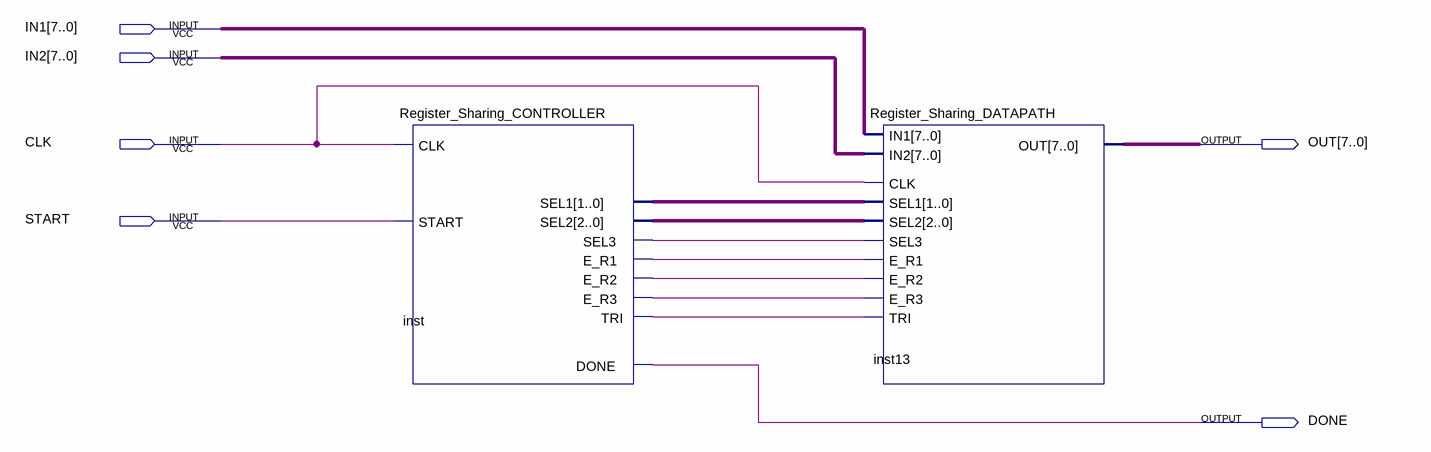
[diagram p0: schematic sheet]
// Quartus schematic Register_Sharing.bdf as structural Verilog: 2 symbols, 6 pins
module Register_Sharing (
  input  [7:0] IN1,
  input  [7:0] IN2,
  input  CLK,
  input  START,
  output [7:0] OUT,
  output DONE
);

  wire inst_e_r1, inst_e_r2, inst_e_r3, inst_sel3, inst_tri;
  wire [1:0] inst_sel1;
  wire [2:0] inst_sel2;

  Register_Sharing_CONTROLLER inst (
    .CLK(CLK), .START(START), .SEL1(inst_sel1), .SEL2(inst_sel2), .SEL3(inst_sel3), .E_R1(inst_e_r1),
    .E_R2(inst_e_r2), .E_R3(inst_e_r3), .TRI(inst_tri), .DONE(DONE));
  Register_Sharing_DATAPATH inst13 (
    .CLK(CLK), .IN1(IN1), .IN2(IN2), .SEL1(inst_sel1), .SEL2(inst_sel2), .SEL3(inst_sel3), .E_R1(inst_e_r1),
    .E_R2(inst_e_r2), .E_R3(inst_e_r3), .TRI(inst_tri), .OUT(OUT));
endmodule
